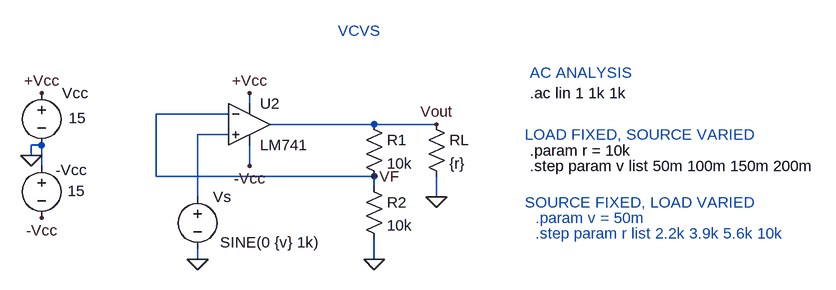
[diagram p0: schematic VCVS.asc]
VCVS.asc, the LTspice schematic file:
Version 4
SHEET 1 1236 680
WIRE 352 112 352 96
WIRE 320 128 208 128
WIRE 544 144 384 144
WIRE 640 144 544 144
WIRE 320 160 272 160
WIRE 32 176 16 176
WIRE 16 192 16 176
WIRE 32 208 32 176
WIRE 352 208 352 176
WIRE 208 224 208 128
WIRE 544 224 208 224
WIRE 544 240 544 224
WIRE 272 256 272 160
WIRE 640 256 640 224
WIRE 272 352 272 336
WIRE 544 352 544 320
FLAG 16 192 0
FLAG 32 96 +Vcc
FLAG 32 288 -Vcc
FLAG 352 96 +Vcc
FLAG 352 208 -Vcc
FLAG 272 352 0
FLAG 544 352 0
FLAG 640 256 0
FLAG 544 224 VF
FLAG 640 144 Vout
SYMBOL voltage 272 240 R0
WINDOW 3 35 86 Left 2
WINDOW 39 0 0 Left 2
SYMATTR Value SINE(0 {v} 1k)
SYMATTR InstName Vs
SYMATTR Value2 AC {v} 0
SYMBOL voltage 32 80 R0
WINDOW 0 32 16 Left 2
WINDOW 3 42 54 Left 2
WINDOW 123 0 0 Left 2
WINDOW 39 135 -14 Left 2
SYMATTR InstName Vcc
SYMATTR Value 15
SYMBOL voltage 32 192 R0
WINDOW 0 22 22 Left 2
WINDOW 3 40 55 Left 2
WINDOW 123 0 0 Left 2
WINDOW 39 131 -86 Left 2
SYMATTR InstName -Vcc
SYMATTR Value 15
SYMBOL Opamps\\LM741 352 80 R0
SYMATTR InstName U2
SYMBOL res 528 128 R0
SYMATTR InstName R1
SYMATTR Value 10k
SYMBOL res 528 224 R0
SYMATTR InstName R2
SYMATTR Value 10k
SYMBOL res 624 128 R0
SYMATTR InstName RL
SYMATTR Value {r}
TEXT 784 96 Left 2 !.ac lin 1 1k 1k
TEXT 792 288 Left 2 ;.param v = 50m
TEXT 784 184 Left 2 !.param r = 10k
TEXT 792 312 Left 2 ;.step param r list 2.2k 3.9k 5.6k 10k
TEXT 784 208 Left 2 !.step param v list 50m 100m 150m 200m
TEXT 488 0 Left 2 ;VCVS
TEXT 784 64 Left 2 ;AC ANALYSIS
TEXT 776 264 Left 2 ;SOURCE FIXED, LOAD VARIED
TEXT 776 160 Left 2 ;LOAD FIXED, SOURCE VARIED

The netlist it stands for:
* VCVS.asc
Vs N001 0 SINE(0 {v} 1k) AC {v} 0
Vcc +Vcc 0 15
V§-Vcc 0 -Vcc 15
XU2 N001 VF +Vcc -Vcc Vout LM741  ; pins In+ In- V+ V- OUT
R1 Vout VF 10k
R2 VF 0 10k
RL Vout 0 {r}
.ac lin 1 1k 1k
* .param v = 50m
.param r = 10k
* .step param r list 2.2k 3.9k 5.6k 10k
.step param v list 50m 100m 150m 200m
* VCVS
* AC ANALYSIS
* SOURCE FIXED, LOAD VARIED
* LOAD FIXED, SOURCE VARIED
.lib LM741.lib
.backanno
.end